# Altium schematic sheet SensWear_MPU.SchDoc
size A4; Size: A4; SheetNumber: 5; SheetTotal: 8
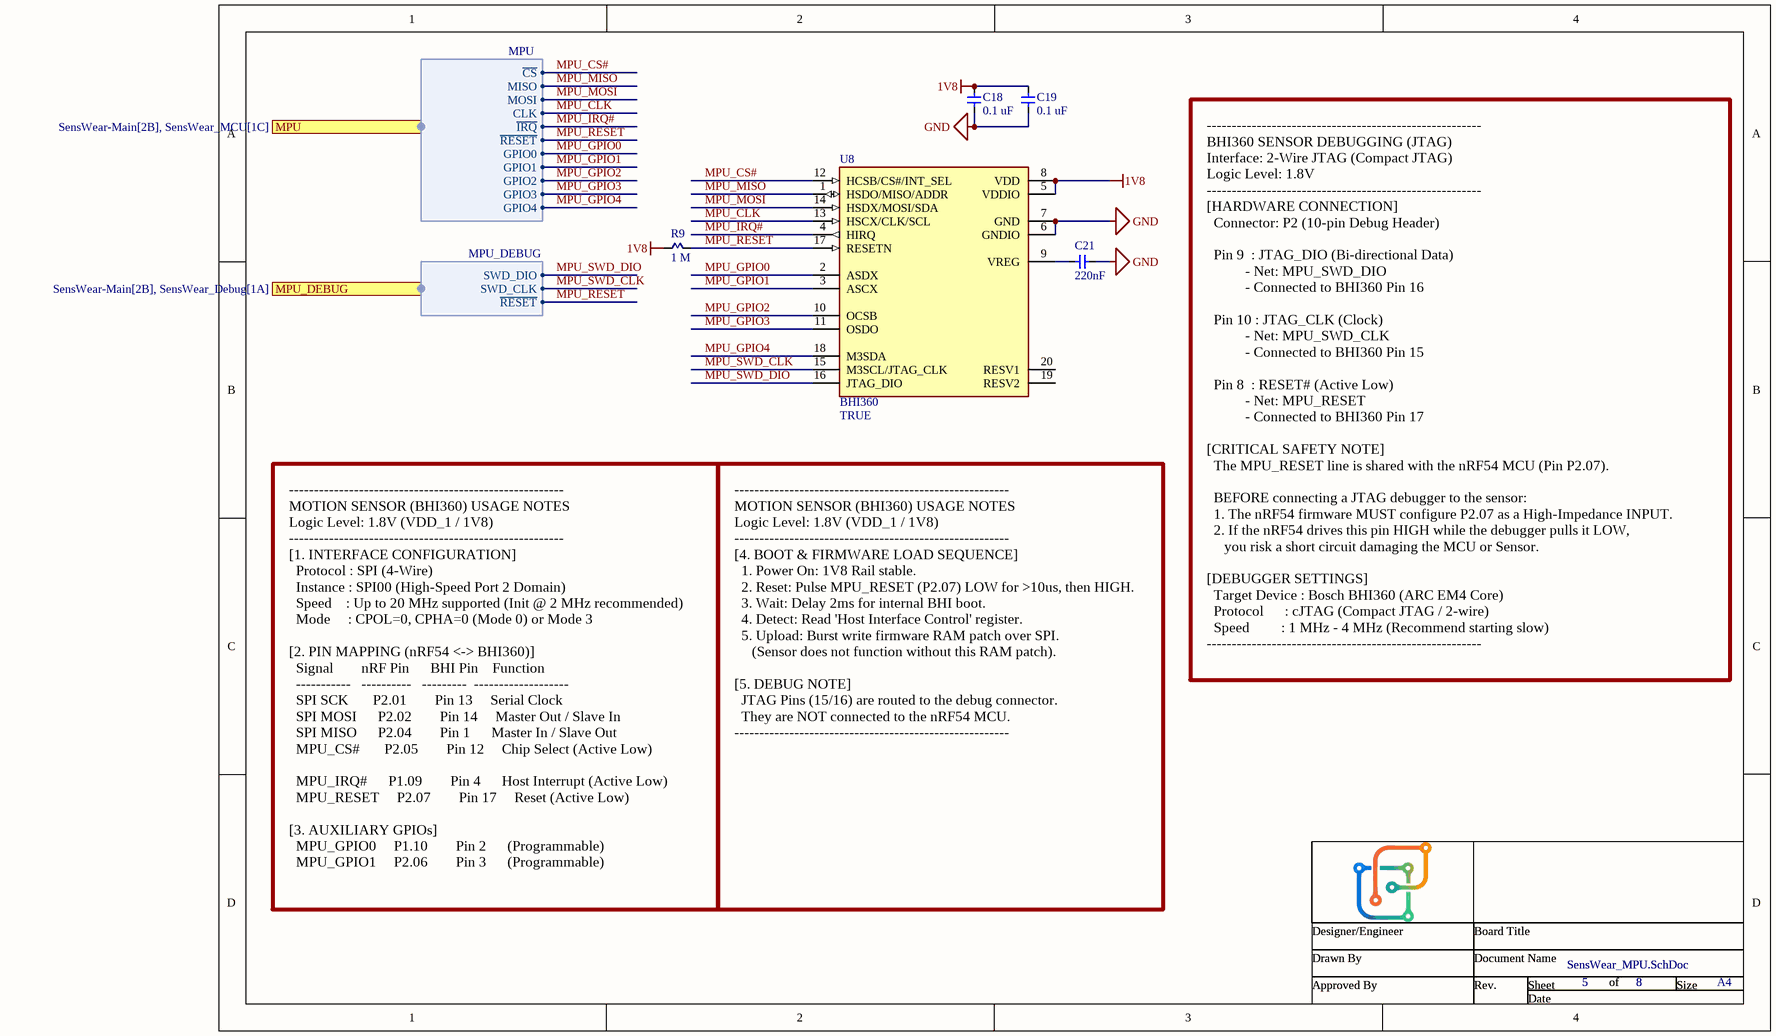
[diagram p0: SensWear_MPU.SchDoc]

## Parts
C18  0.1 uF  [CAPC1005X05N]
C19  0.1 uF  [CAPC1005X05N]
C21  220nF  [CAPC1005X05N]
R9  1 M  [RESC1005X04N]
U8  BHI360  Checked: TRUE  [BHI360]

## Ports
MPU (harness MPU, see SensWear-Main[2B], SensWear_MCU[1C]), MPU_DEBUG (harness MPU_DEBUG, see SensWear-Main[2B], SensWear_Debug[1A])

## Harnesses
MPU: ~{CS}, MISO, MOSI, CLK, ~{IRQ}, ~{RESET}, GPIO0, GPIO1, GPIO2, GPIO3, GPIO4
MPU_DEBUG: SWD_DIO, SWD_CLK, ~{RESET}

## Nets
1V8: C18.2 C19.2 R9.1 U8.5(VDDIO) U8.8(VDD)
GND: C18.1 C19.1 C21.2 U8.6(GNDIO) U8.7(GND)
MPU_CLK: U8.13(HSCX/CLK/SCL) ; port MPU.CLK
MPU_CS#: U8.12(HCSB/CS#/INT_SEL) ; port MPU.~{CS}
MPU_GPIO0: U8.2(ASDX) ; port MPU.GPIO0
MPU_GPIO1: U8.3(ASCX) ; port MPU.GPIO1
MPU_GPIO2: U8.10(OCSB) ; port MPU.GPIO2
MPU_GPIO3: U8.11(OSDO) ; port MPU.GPIO3
MPU_GPIO4: U8.18(M3SDA) ; port MPU.GPIO4
MPU_IRQ#: U8.4(HIRQ) ; port MPU.~{IRQ}
MPU_MISO: U8.1(HSDO/MISO/ADDR) ; port MPU.MISO
MPU_MOSI: U8.14(HSDX/MOSI/SDA) ; port MPU.MOSI
MPU_~{RESET}: R9.2 U8.17(RESETN) ; port MPU.~{RESET}, port MPU_DEBUG.~{RESET}
MPU_SWD_CLK: U8.15(M3SCL/JTAG_CLK) ; port MPU_DEBUG.SWD_CLK
MPU_SWD_DIO: U8.16(JTAG_DIO) ; port MPU_DEBUG.SWD_DIO
NetC21_1: C21.1 U8.9(VREG)

Not connected (* = marked no-connect by the designer): U8 19(RESV2) 20(RESV1)

## Notes on the sheet
- -------------------------------------------------------
  BHI360 SENSOR DEBUGGING (JTAG)
  Interface: 2-Wire JTAG (Compact JTAG)
  Logic Level: 1.8V
  -------------------------------------------------------
  [HARDWARE CONNECTION]
  Connector: P2 (10-pin Debug Header)
  Pin 9  : JTAG_DIO (Bi-directional Data)
  - Net: MPU_SWD_DIO
  - Connected to BHI360 Pin 16
  Pin 10 : JTAG_CLK (Clock)
  - Net: MPU_SWD_CLK
  - Connected to BHI360 Pin 15
  Pin 8  : RESET# (Active Low)
  - Net: MPU_RESET
  - Connected to BHI360 Pin 17
  [CRITICAL SAFETY NOTE]
  The MPU_RESET line is shared with the nRF54 MCU (Pin P2.07).
  BEFORE connecting a JTAG debugger to the sensor:
  1. The nRF54 firmware MUST configure P2.07 as a High-Impedance INPUT.
  2. If the nRF54 drives this pin HIGH while the debugger pulls it LOW,
  you risk a short circuit damaging the MCU or Sensor.
  [DEBUGGER SETTINGS]
  Target Device : Bosch BHI360 (ARC EM4 Core)
  Protocol      : cJTAG (Compact JTAG / 2-wire)
  Speed         : 1 MHz - 4 MHz (Recommend starting slow)
  -------------------------------------------------------
- -------------------------------------------------------
  MOTION SENSOR (BHI360) USAGE NOTES
  Logic Level: 1.8V (VDD_1 / 1V8)
  -------------------------------------------------------
  [1. INTERFACE CONFIGURATION]
  Protocol : SPI (4-Wire)
  Instance : SPI00 (High-Speed Port 2 Domain)
  Speed    : Up to 20 MHz supported (Init @ 2 MHz recommended)
  Mode     : CPOL=0, CPHA=0 (Mode 0) or Mode 3
  [2. PIN MAPPING (nRF54 <-> BHI360)]
  Signal        nRF Pin      BHI Pin    Function
  -----------   ----------   ---------  -------------------
  SPI SCK       P2.01        Pin 13     Serial Clock
  SPI MOSI      P2.02        Pin 14     Master Out / Slave In
  SPI MISO      P2.04        Pin 1      Master In / Slave Out
  MPU_CS#       P2.05        Pin 12     Chip Select (Active Low)
  MPU_IRQ#      P1.09        Pin 4      Host Interrupt (Active Low)
  MPU_RESET     P2.07        Pin 17     Reset (Active Low)
  [3. AUXILIARY GPIOs]
  MPU_GPIO0     P1.10        Pin 2      (Programmable)
  MPU_GPIO1     P2.06        Pin 3      (Programmable)
- -------------------------------------------------------
  MOTION SENSOR (BHI360) USAGE NOTES
  Logic Level: 1.8V (VDD_1 / 1V8)
  -------------------------------------------------------
  [4. BOOT & FIRMWARE LOAD SEQUENCE]
  1. Power On: 1V8 Rail stable.
  2. Reset: Pulse MPU_RESET (P2.07) LOW for >10us, then HIGH.
  3. Wait: Delay 2ms for internal BHI boot.
  4. Detect: Read 'Host Interface Control' register.
  5. Upload: Burst write firmware RAM patch over SPI.
  (Sensor does not function without this RAM patch).
  [5. DEBUG NOTE]
  JTAG Pins (15/16) are routed to the debug connector.
  They are NOT connected to the nRF54 MCU.
  -------------------------------------------------------
- Designer/Engineer
- Drawn By
- Document Name
- Board Title
- Sheet
- of
- Size
- A4
- Approved By
- Rev.
- Date

## Library data of the parts
C18 C19 = GRM155R61C104KA88D: CAP CER 0.1UF 16V X5R 0402; Manufacturer: Murata Electronics; Tolerance: 10 %; Type: Chip Multilayer Ceramic Capacitor for General Purpose; Voltage Rating DC: 16 VDC; Capacitance - nF: 100 nF; Capacitance - pF: 100000 pF; Manufacturer Part Number: GRM155R61C104KA88D; RoHS: RoHS Compliant; Category: Multilayer Ceramic Capacitors MLCC - SMD/SMT; Stock: 0; Pricing: 1=0.082, 10=0.026, 100=0.011, 500=0.008, 1000=0.007, 2500=0.006, 5000=0.005, 10000=0.004 (EUR); Capacitance: 0.1 uF; Height: 0.5 mm; Length: 1 mm; Package / Case: 0402 (1005 metric); Packaging: Cut Tape; Product: General Type MLCCs; Series: GRM; Termination Style: SMD/SMT; Width: 0.5 mm; Brand: Murata Electronics; Case Code - in: 0402; Case Code - mm: 1005; Dielectric: X5R; Maximum Operating Temperature: + 85 C; Minimum Operating Temperature: - 55 C; Standard Pack Qty: 10000; Termination: Standard; RoHS - Mouser: Y; Minimum Order Quantity: 1; Reeling: True; ComponentLink1URL: http://www.mouser.com/datasheet/2/281/murata_03052018_GRM_Series_1-1310166.pdf; ComponentLink1Description: http://www.mouser.com/datasheet/2/281/murata_03052018_GRM_Series_1-1310166.pdf; Value: 0.1 uF; Supplier 1: Mouser; Supplier Part Number 1: 81-GRM155R61C104KA8D; Supplier 2: Digikey; Supplier Part Number 2: 490-5415-1-ND; Supplier 3: Digikey; Supplier Part Number 3: 490-5415-6-ND
C21 = GRM155R61C224KA12D: CAP CER 0.22UF 16V X5R 0402; Manufacturer: Murata; Supplier: Mouser; Supplier Part Number: 81-GRM155R61C224KA2D; Manufacturer Part Number: GRM155R61C224KA12D; RoHS: Yes; Category: Ceramic Capacitors; Stock: 8589; Pricing: 1=0.1, 10=0.043, 50=0.043, 100=0.026, 1000=0.017, 10000=0.009 (USD); Lead Free: 5697LeadFree; ComponentLink1URL: http://www.mouser.com/ds/2/281/c02e-2905.pdf?src-supplier=Mouser; ComponentLink1Description: http://www.mouser.com/ds/2/281/c02e-2905.pdf?src-supplier=Mouser; ComponentLink2URL: https://www.murata.com/~/media/webrenewal/support/library/catalog/products/capacitor/mlcc/c02e.ashx?la=en-us&src-supplier=Digikey; ComponentLink2Description: https://www.murata.com/~/media/webrenewal/support/library/catalog/products/capacitor/mlcc/c02e.ashx?la=en-us&src-supplier=Digikey; ComponentLink3URL: http://search.murata.co.jp/Ceramy/image/img/A01X/G101/ENG/GRM155R61C224KA12-01.pdf?src-supplier=Digikey; ComponentLink3Description: http://search.murata.co.jp/Ceramy/image/img/A01X/G101/ENG/GRM155R61C224KA12-01.pdf?src-supplier=Digikey; ComponentLink4URL: http://search.murata.co.jp/Ceramy/image/img/A01X/partnumbering_e_01.pdf?src-supplier=Digikey; ComponentLink4Description: http://search.murata.co.jp/Ceramy/image/img/A01X/partnumbering_e_01.pdf?src-supplier=Digikey; ComponentLink5URL: https://datasheet.octopart.com/GRM155R61C224KA12D-Murata-datasheet-22122223.pdf?src-supplier=Future+Electronics; ComponentLink5Description: https://datasheet.octopart.com/GRM155R61C224KA12D-Murata-datasheet-22122223.pdf?src-supplier=Future+Electronics; Value: 220nF; Supplier 1: Mouser; Supplier Part Number 1: 81-GRM155R61C224KA2D; Supplier 2: Digikey; Supplier Part Number 2: 490-11416-1-ND
R9 = ERJ-2RKF1004X: RES SMD 1M OHM 1% 1/10W 0402; Manufacturer: Panasonic Electronic Components; Power (Watts): 0.1W, 1/10W; Temperature Coefficient: ±100ppm/°C; Supplier 1: Digi-Key; Manufacturer Part Number: ERJ-2RKF1004X; RoHS: RoHS Compliant; Category: Resistors; Stock 1: 1590446; Pricing 1: 1=0.1, 10=0.025, 25=0.018, 50=0.0136, 100=0.01, 250=0.00764, 500=0.00612, 1000=0.00451, 5000=0.00323 (USD); Packaging: Digi-Reel®; Part Status: Active; Resistance (Ohms): 1M; Tolerance: ±1%; Composition: Thick Film; Features: Automotive AEC-Q200; Operating Temperature: -55°C ~ 155°C; Package / Case: 0402 (1005 Metric); Supplier Device Package: 0402; Size / Dimension: 0.039" L x 0.020" W (1.00mm x 0.50mm); Height - Seated (Max): 0.016" (0.40mm); Number of Terminations: 2; Failure Rate: -; ComponentLink1URL: https://industrial.panasonic.com/cdbs/www-data/pdf/RDA0000/AOA0000C283.pdf; ComponentLink1Description: https://industrial.panasonic.com/cdbs/www-data/pdf/RDA0000/AOA0000C283.pdf; Supplier Part Number 1: P1.00MLDKR-ND; Value: 1 M
U8 = BHI360: Programmable smart sensor combining accelerometer, gyroscope and fusion software; Manufacturer: Bosch Tools; Supplier: Digikey; Supplier Part Number: 828-BHI360DKR-ND; Manufacturer Part Number: BHI360; RoHS: No; Category: Uncategorized; Stock: 17060; Pricing: 1=6.54, 10=5.232, 25=4.8396, 100=4.1854, 500=3.92384, 1000=3.66226 (USD); Supplier 1: Digikey; Supplier Part Number 1: 828-BHI360DKR-ND; Supplier 2: Mouser; Supplier Part Number 2: 262-BHI360